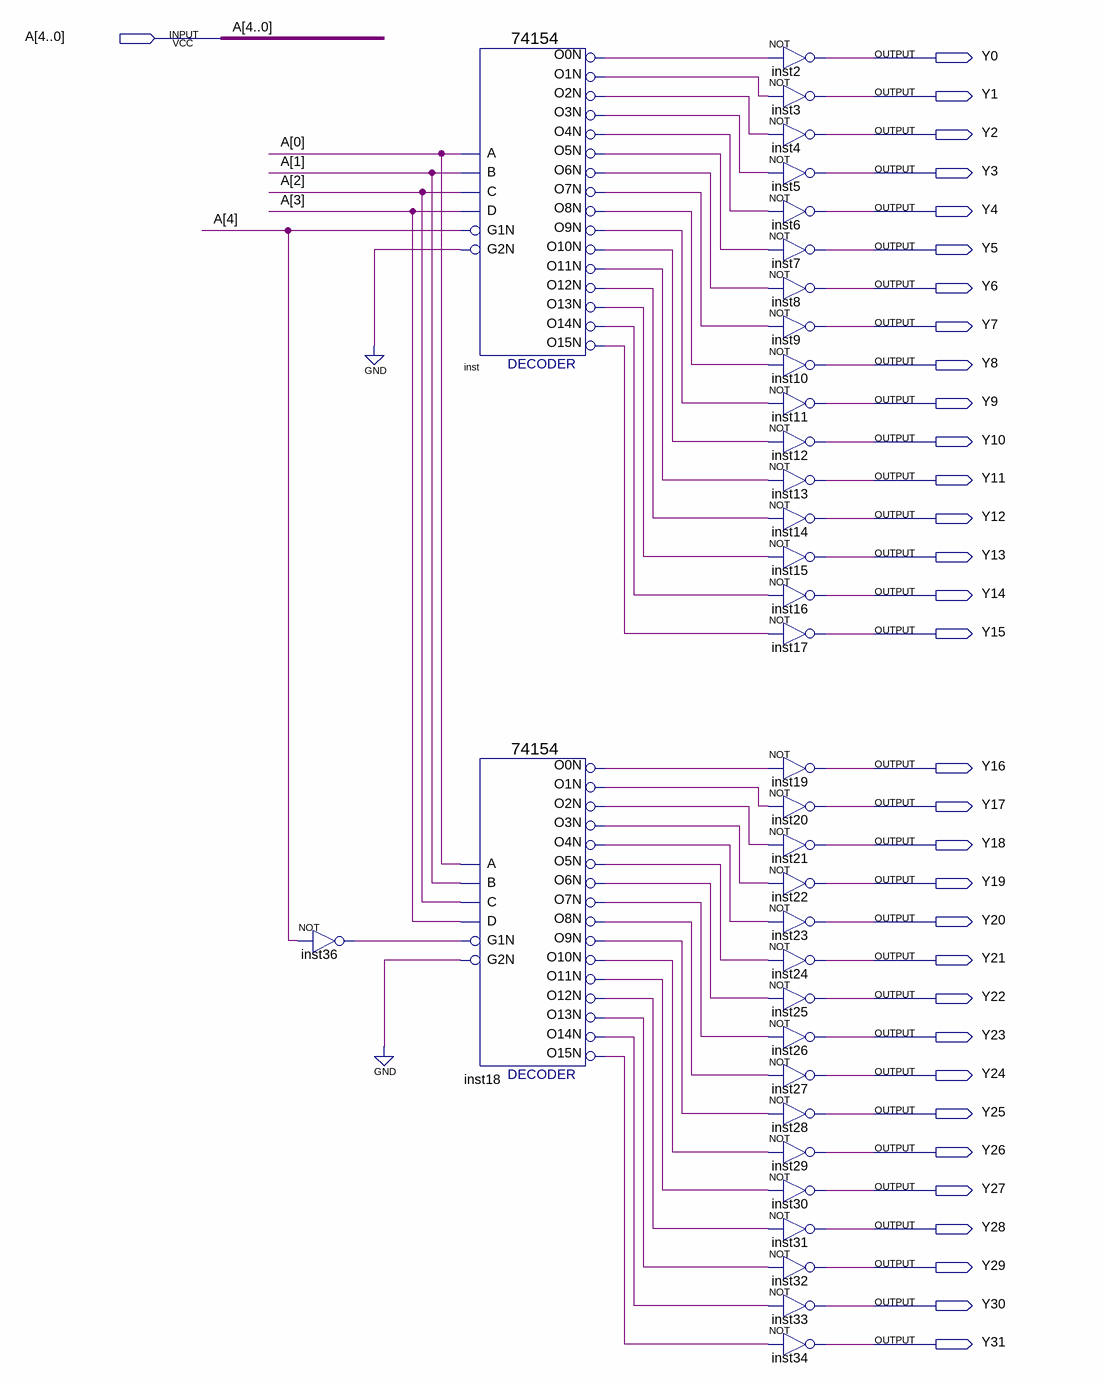
[diagram p0: schematic sheet]
// Quartus schematic Decoder_5_32.bdf as structural Verilog: 35 symbols, 33 pins
module Decoder_5_32 (
  input  [4:0] A,
  output Y0,
  output Y1,
  output Y2,
  output Y3,
  output Y4,
  output Y5,
  output Y6,
  output Y7,
  output Y8,
  output Y9,
  output Y10,
  output Y11,
  output Y12,
  output Y13,
  output Y14,
  output Y15,
  output Y16,
  output Y17,
  output Y18,
  output Y19,
  output Y20,
  output Y21,
  output Y22,
  output Y23,
  output Y24,
  output Y25,
  output Y26,
  output Y27,
  output Y28,
  output Y29,
  output Y30,
  output Y31
);

  wire inst18_o0n, inst18_o1n, inst18_o2n, inst18_o3n, inst18_o4n, inst18_o5n, inst18_o6n, inst18_o7n,
       inst18_o8n, inst18_o9n, inst18_o10n, inst18_o11n, inst18_o12n, inst18_o13n, inst18_o14n, inst18_o15n,
       inst36_out, inst_o0n, inst_o1n, inst_o2n, inst_o3n, inst_o4n, inst_o5n, inst_o6n, inst_o7n, inst_o8n,
       inst_o9n, inst_o10n, inst_o11n, inst_o12n, inst_o13n, inst_o14n, inst_o15n;

  not inst36 (inst36_out, A[4]);
  \74154  inst (
    .C(A[2]), .D(A[3]), .B(A[1]), .A(A[0]), .G1N(A[4]), .G2N(1'b0), .O0N(inst_o0n), .O12N(inst_o12n),
    .O15N(inst_o15n), .O10N(inst_o10n), .O11N(inst_o11n), .O1N(inst_o1n), .O13N(inst_o13n), .O14N(inst_o14n),
    .O4N(inst_o4n), .O3N(inst_o3n), .O2N(inst_o2n), .O7N(inst_o7n), .O6N(inst_o6n), .O5N(inst_o5n),
    .O9N(inst_o9n), .O8N(inst_o8n));
  \74154  inst18 (
    .C(A[2]), .D(A[3]), .B(A[1]), .A(A[0]), .G1N(inst36_out), .G2N(1'b0), .O0N(inst18_o0n),
    .O12N(inst18_o12n), .O15N(inst18_o15n), .O10N(inst18_o10n), .O11N(inst18_o11n), .O1N(inst18_o1n),
    .O13N(inst18_o13n), .O14N(inst18_o14n), .O4N(inst18_o4n), .O3N(inst18_o3n), .O2N(inst18_o2n),
    .O7N(inst18_o7n), .O6N(inst18_o6n), .O5N(inst18_o5n), .O9N(inst18_o9n), .O8N(inst18_o8n));
  not inst2 (Y0, inst_o0n);
  not inst3 (Y1, inst_o1n);
  not inst4 (Y2, inst_o2n);
  not inst5 (Y3, inst_o3n);
  not inst6 (Y4, inst_o4n);
  not inst7 (Y5, inst_o5n);
  not inst8 (Y6, inst_o6n);
  not inst9 (Y7, inst_o7n);
  not inst10 (Y8, inst_o8n);
  not inst11 (Y9, inst_o9n);
  not inst12 (Y10, inst_o10n);
  not inst13 (Y11, inst_o11n);
  not inst14 (Y12, inst_o12n);
  not inst15 (Y13, inst_o13n);
  not inst16 (Y14, inst_o14n);
  not inst17 (Y15, inst_o15n);
  not inst19 (Y16, inst18_o0n);
  not inst20 (Y17, inst18_o1n);
  not inst21 (Y18, inst18_o2n);
  not inst22 (Y19, inst18_o3n);
  not inst23 (Y20, inst18_o4n);
  not inst24 (Y21, inst18_o5n);
  not inst25 (Y22, inst18_o6n);
  not inst26 (Y23, inst18_o7n);
  not inst27 (Y24, inst18_o8n);
  not inst28 (Y25, inst18_o9n);
  not inst29 (Y26, inst18_o10n);
  not inst30 (Y27, inst18_o11n);
  not inst31 (Y28, inst18_o12n);
  not inst32 (Y29, inst18_o13n);
  not inst33 (Y30, inst18_o14n);
  not inst34 (Y31, inst18_o15n);
endmodule
